# EAGLE design roadkill (EAGLE 6.1)

## Sheet 1 of 5
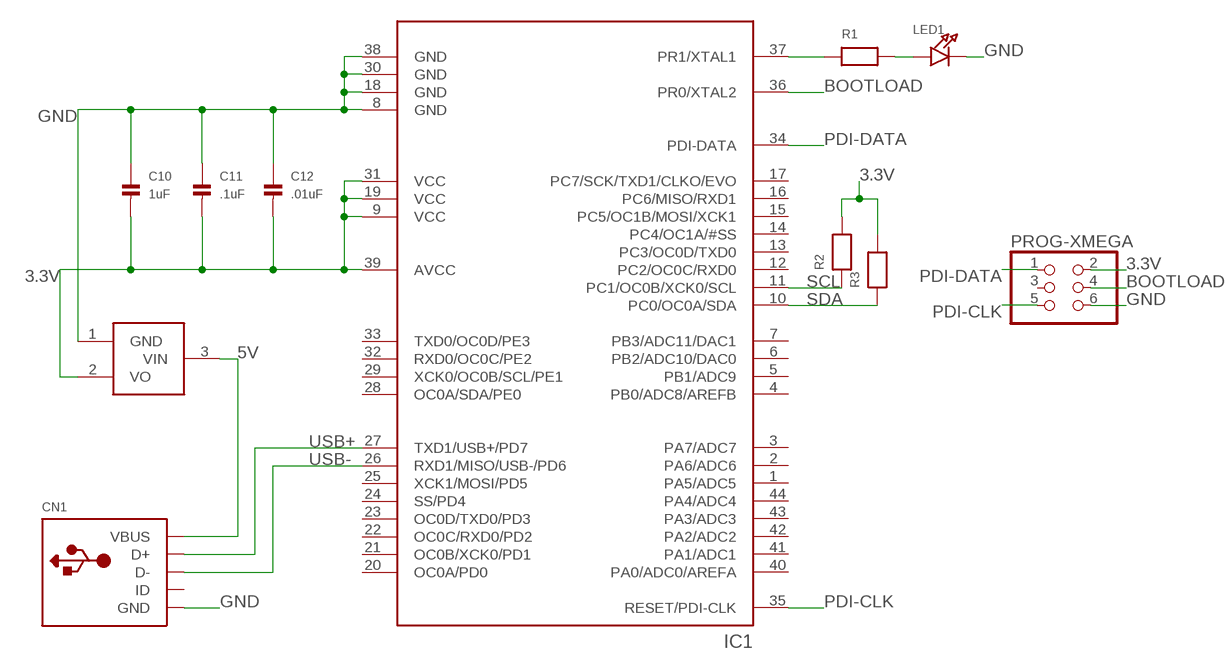
[diagram p0: schematic, sheet 1]

### Parts
3.3V  VREG  [SOT23-3]
C10  1uF  CAP_CERAMIC0603  [0603]
C11  .1uF  CAP_CERAMIC0603  [0603]
C12  .01uF  CAP_CERAMIC0603  [0603]
CN1  USBMINIB  [USB-MINIB]
IC1  ATXMEGAXXA4U  [TQFP-44]
LED1  LED0603  [CHIPLED_0603]
PROG-XMEGA  HEADER-2X3  [2X03]
R1  RESISTOR0603  [0603]
R2  RESISTOR0603  [0603]
R3  RESISTOR0603  [0603]

### Nets
3.3V: 3.3V.2(VO) C10.2 C11.2 C12.2 IC1.9(VCC) IC1.19(VCC) IC1.31(VCC) IC1.39(AVCC) PROG-XMEGA.2 R2.2 R3.2 ; also sheet 2,3,4,5
5V: 3.3V.3(VIN) CN1.VBUS
BOOTLOAD: IC1.36(PR0/XTAL2) PROG-XMEGA.4
GND: 3.3V.1(GND) C10.1 C11.1 C12.1 CN1.GND IC1.8(GND) IC1.18(GND) IC1.30(GND) IC1.38(GND) LED1.C PROG-XMEGA.6 ; also sheet 2,3,4,5
PDI-CLK: IC1.35(RESET/PDI-CLK) PROG-XMEGA.5
PDI-DATA: IC1.34(PDI-DATA) PROG-XMEGA.1
PR1: IC1.37(PR1/XTAL1) R1.1
PR1-P: LED1.A R1.2
SCL: IC1.11(PC1/OC0B/XCK0/SCL) R2.1 ; also sheet 2,3,4,5
SDA: IC1.10(PC0/OC0A/SDA) R3.1 ; also sheet 2,3,4,5
USB+: CN1.D+ IC1.27(TXD1/USB+/PD7)
USB-: CN1.D- IC1.26(RXD1/MISO/USB-/PD6)
Unconnected: CN1.ID IC1.1(PA5/ADC5) IC1.2(PA6/ADC6) IC1.3(PA7/ADC7) IC1.4(PB0/ADC8/AREFB) IC1.5(PB1/ADC9) IC1.6(PB2/ADC10/DAC0) IC1.7(PB3/ADC11/DAC1) IC1.12(PC2/OC0C/RXD0) IC1.13(PC3/OC0D/TXD0) IC1.14(PC4/OC1A/#SS) IC1.15(PC5/OC1B/MOSI/XCK1) IC1.16(PC6/MISO/RXD1) IC1.17(PC7/SCK/TXD1/CLKO/EVO) IC1.20(OC0A/PD0) IC1.21(OC0B/XCK0/PD1) IC1.22(OC0C/RXD0/PD2) IC1.23(OC0D/TXD0/PD3) IC1.24(SS/PD4) IC1.25(XCK1/MOSI/PD5) IC1.28(OC0A/SDA/PE0) IC1.29(XCK0/OC0B/SCL/PE1) IC1.32(RXD0/OC0C/PE2) IC1.33(TXD0/OC0D/PE3) IC1.40(PA0/ADC0/AREFA) IC1.41(PA1/ADC1) IC1.42(PA2/ADC2) IC1.43(PA3/ADC3) IC1.44(PA4/ADC4) PROG-XMEGA.3

## Sheet 2 of 5
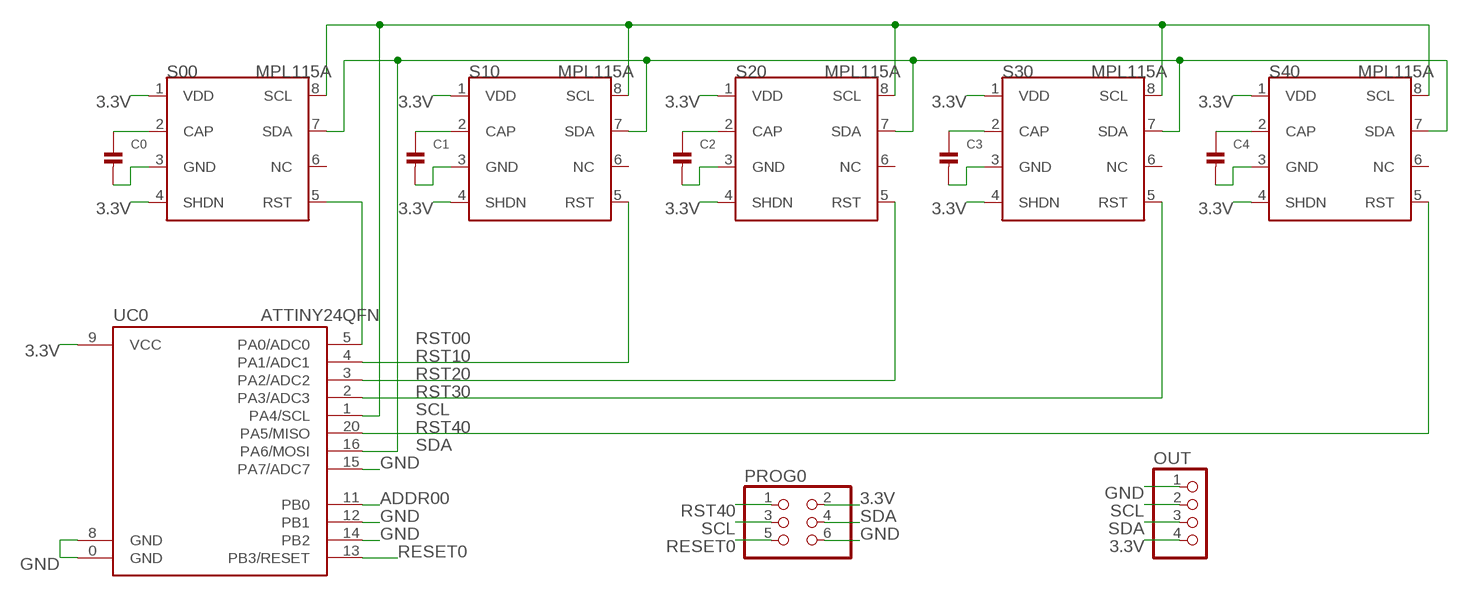
[diagram p1: schematic, sheet 2]

### Parts
C0  CAP_CERAMIC0603  [0603]
C1  CAP_CERAMIC0603  [0603]
C2  CAP_CERAMIC0603  [0603]
C3  CAP_CERAMIC0603  [0603]
C4  CAP_CERAMIC0603  [0603]
OUT  HEADER-1X4  [1X04_OVAL]
PROG0  HEADER-2X3  [2X03]
S00  MPL115A  [LGA-8]
S10  MPL115A  [LGA-8]
S20  MPL115A  [LGA-8]
S30  MPL115A  [LGA-8]
S40  MPL115A  [LGA-8]
UC0  ATTINY24QFN  [QFN20]

### Nets
3.3V: OUT.4 PROG0.2 S00.1(VDD) S00.4(SHDN) S10.1(VDD) S10.4(SHDN) S20.1(VDD) S20.4(SHDN) S30.1(VDD) S30.4(SHDN) S40.1(VDD) S40.4(SHDN) UC0.9(VCC) ; also sheet 1,3,4,5
ADDR00: UC0.11(PB0)
CAP00: C0.1 S00.2(CAP)
CAP10: C1.1 S10.2(CAP)
CAP20: C2.1 S20.2(CAP)
CAP30: C3.1 S30.2(CAP)
CAP40: C4.1 S40.2(CAP)
GND: C0.2 C1.2 C2.2 C3.2 C4.2 OUT.1 PROG0.6 S00.3(GND) S10.3(GND) S20.3(GND) S30.3(GND) S40.3(GND) UC0.0(GND) UC0.8(GND) UC0.12(PB1) UC0.14(PB2) UC0.15(PA7/ADC7) ; also sheet 1,3,4,5
RESET0: PROG0.5 UC0.13(PB3/RESET)
RST00: S00.5(RST) UC0.5(PA0/ADC0)
RST10: S10.5(RST) UC0.4(PA1/ADC1)
RST20: S20.5(RST) UC0.3(PA2/ADC2)
RST30: S30.5(RST) UC0.2(PA3/ADC3)
RST40: PROG0.1 S40.5(RST) UC0.20(PA5/MISO)
SCL: OUT.2 PROG0.3 S00.8(SCL) S10.8(SCL) S20.8(SCL) S30.8(SCL) S40.8(SCL) UC0.1(PA4/SCL) ; also sheet 1,3,4,5
SDA: OUT.3 PROG0.4 S00.7(SDA) S10.7(SDA) S20.7(SDA) S30.7(SDA) S40.7(SDA) UC0.16(PA6/MOSI) ; also sheet 1,3,4,5
Unconnected: S00.6(NC) S10.6(NC) S20.6(NC) S30.6(NC) S40.6(NC)

## Sheet 3 of 5
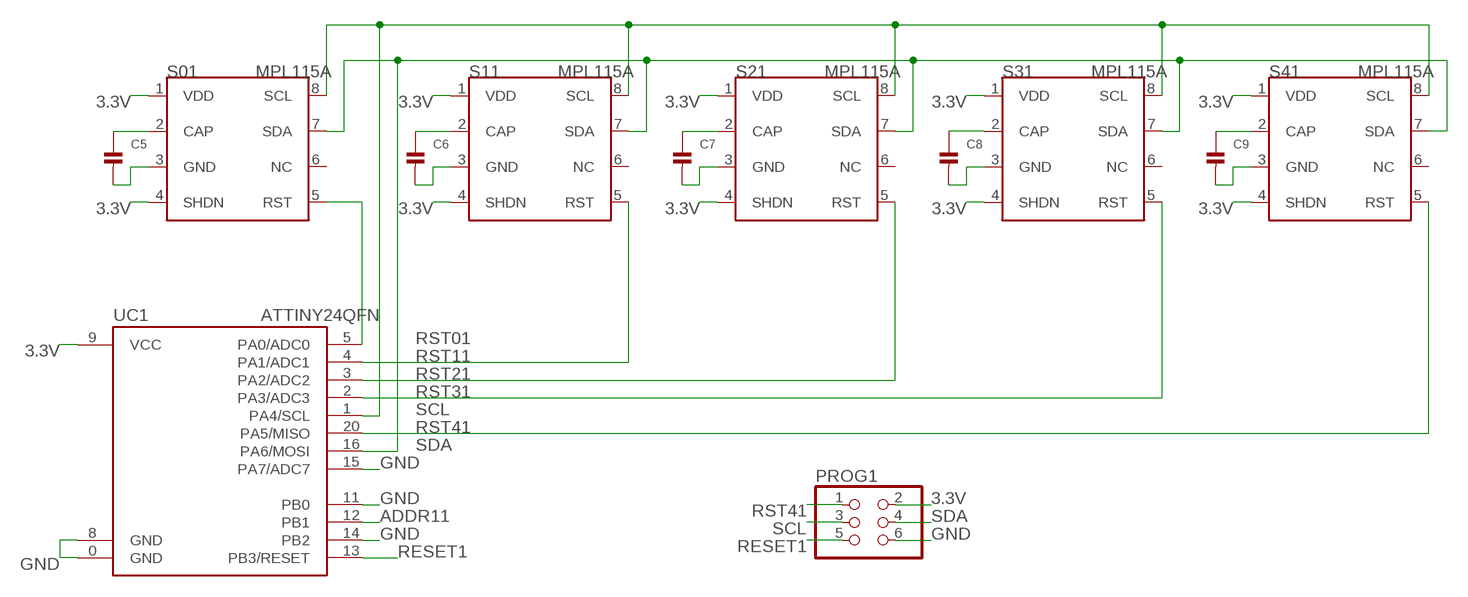
[diagram p2: schematic, sheet 3]

### Parts
C5  CAP_CERAMIC0603  [0603]
C6  CAP_CERAMIC0603  [0603]
C7  CAP_CERAMIC0603  [0603]
C8  CAP_CERAMIC0603  [0603]
C9  CAP_CERAMIC0603  [0603]
PROG1  HEADER-2X3  [2X03]
S01  MPL115A  [LGA-8]
S11  MPL115A  [LGA-8]
S21  MPL115A  [LGA-8]
S31  MPL115A  [LGA-8]
S41  MPL115A  [LGA-8]
UC1  ATTINY24QFN  [QFN20]

### Nets
3.3V: PROG1.2 S01.1(VDD) S01.4(SHDN) S11.1(VDD) S11.4(SHDN) S21.1(VDD) S21.4(SHDN) S31.1(VDD) S31.4(SHDN) S41.1(VDD) S41.4(SHDN) UC1.9(VCC) ; also sheet 1,2,4,5
ADDR11: UC1.12(PB1)
CAP01: C5.1 S01.2(CAP)
CAP11: C6.1 S11.2(CAP)
CAP21: C7.1 S21.2(CAP)
CAP31: C8.1 S31.2(CAP)
CAP41: C9.1 S41.2(CAP)
GND: C5.2 C6.2 C7.2 C8.2 C9.2 PROG1.6 S01.3(GND) S11.3(GND) S21.3(GND) S31.3(GND) S41.3(GND) UC1.0(GND) UC1.8(GND) UC1.11(PB0) UC1.14(PB2) UC1.15(PA7/ADC7) ; also sheet 1,2,4,5
RESET1: PROG1.5 UC1.13(PB3/RESET)
RST01: S01.5(RST) UC1.5(PA0/ADC0)
RST11: S11.5(RST) UC1.4(PA1/ADC1)
RST21: S21.5(RST) UC1.3(PA2/ADC2)
RST31: S31.5(RST) UC1.2(PA3/ADC3)
RST41: PROG1.1 S41.5(RST) UC1.20(PA5/MISO)
SCL: PROG1.3 S01.8(SCL) S11.8(SCL) S21.8(SCL) S31.8(SCL) S41.8(SCL) UC1.1(PA4/SCL) ; also sheet 1,2,4,5
SDA: PROG1.4 S01.7(SDA) S11.7(SDA) S21.7(SDA) S31.7(SDA) S41.7(SDA) UC1.16(PA6/MOSI) ; also sheet 1,2,4,5
Unconnected: S01.6(NC) S11.6(NC) S21.6(NC) S31.6(NC) S41.6(NC)

## Sheet 4 of 5
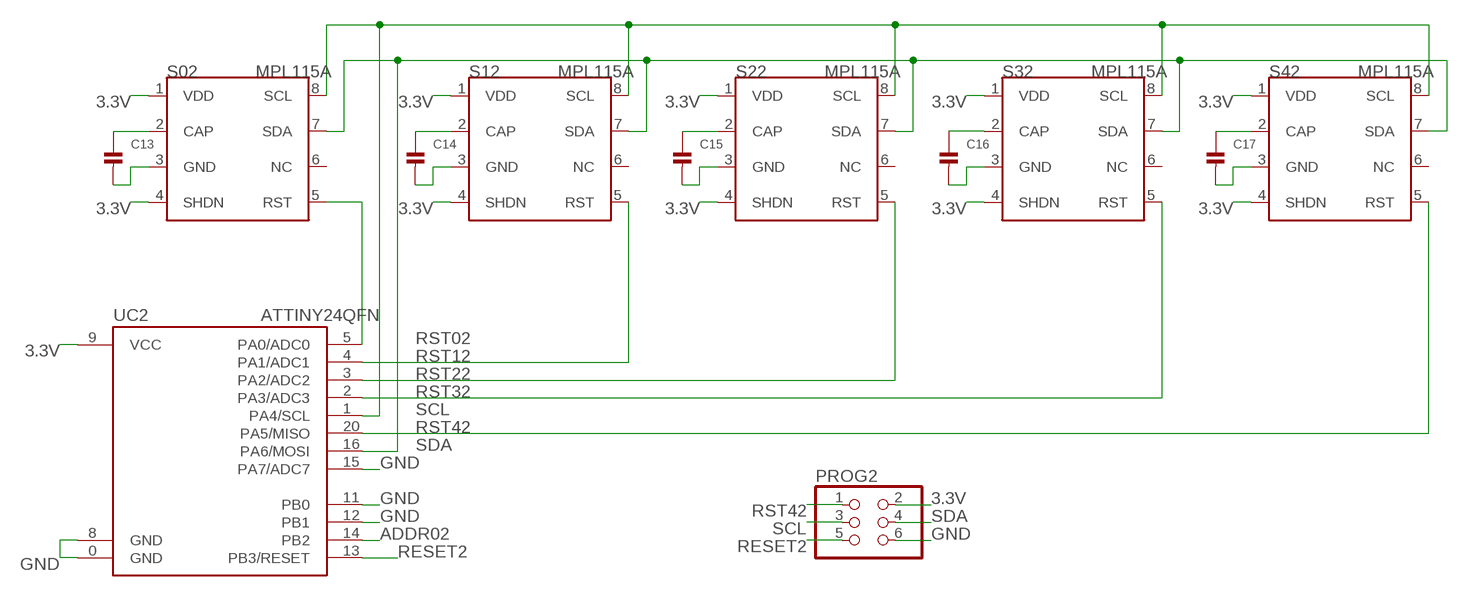
[diagram p3: schematic, sheet 4]

### Parts
C13  CAP_CERAMIC0603  [0603]
C14  CAP_CERAMIC0603  [0603]
C15  CAP_CERAMIC0603  [0603]
C16  CAP_CERAMIC0603  [0603]
C17  CAP_CERAMIC0603  [0603]
PROG2  HEADER-2X3  [2X03]
S02  MPL115A  [LGA-8]
S12  MPL115A  [LGA-8]
S22  MPL115A  [LGA-8]
S32  MPL115A  [LGA-8]
S42  MPL115A  [LGA-8]
UC2  ATTINY24QFN  [QFN20]

### Nets
3.3V: PROG2.2 S02.1(VDD) S02.4(SHDN) S12.1(VDD) S12.4(SHDN) S22.1(VDD) S22.4(SHDN) S32.1(VDD) S32.4(SHDN) S42.1(VDD) S42.4(SHDN) UC2.9(VCC) ; also sheet 1,2,3,5
ADDR02: UC2.14(PB2)
CAP02: C13.1 S02.2(CAP)
CAP12: C14.1 S12.2(CAP)
CAP22: C15.1 S22.2(CAP)
CAP32: C16.1 S32.2(CAP)
CAP42: C17.1 S42.2(CAP)
GND: C13.2 C14.2 C15.2 C16.2 C17.2 PROG2.6 S02.3(GND) S12.3(GND) S22.3(GND) S32.3(GND) S42.3(GND) UC2.0(GND) UC2.8(GND) UC2.11(PB0) UC2.12(PB1) UC2.15(PA7/ADC7) ; also sheet 1,2,3,5
RESET2: PROG2.5 UC2.13(PB3/RESET)
RST02: S02.5(RST) UC2.5(PA0/ADC0)
RST12: S12.5(RST) UC2.4(PA1/ADC1)
RST22: S22.5(RST) UC2.3(PA2/ADC2)
RST32: S32.5(RST) UC2.2(PA3/ADC3)
RST42: PROG2.1 S42.5(RST) UC2.20(PA5/MISO)
SCL: PROG2.3 S02.8(SCL) S12.8(SCL) S22.8(SCL) S32.8(SCL) S42.8(SCL) UC2.1(PA4/SCL) ; also sheet 1,2,3,5
SDA: PROG2.4 S02.7(SDA) S12.7(SDA) S22.7(SDA) S32.7(SDA) S42.7(SDA) UC2.16(PA6/MOSI) ; also sheet 1,2,3,5
Unconnected: S02.6(NC) S12.6(NC) S22.6(NC) S32.6(NC) S42.6(NC)

## Sheet 5 of 5
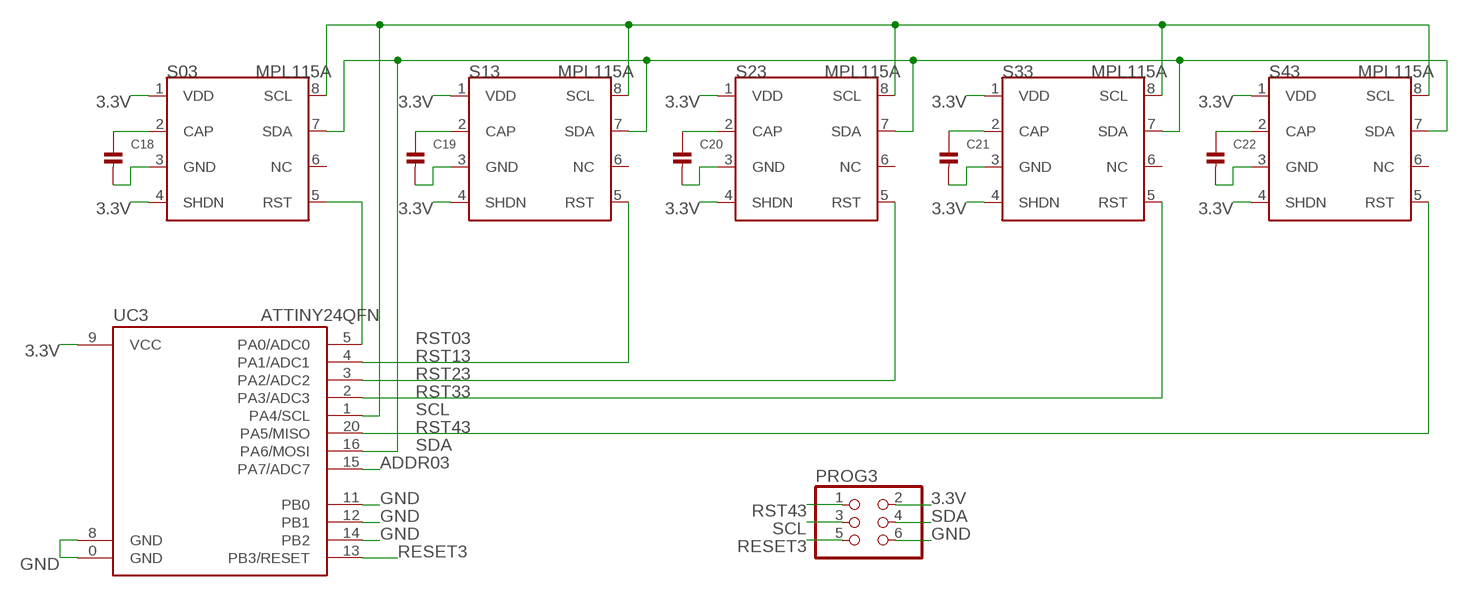
[diagram p4: schematic, sheet 5]

### Parts
C18  CAP_CERAMIC0603  [0603]
C19  CAP_CERAMIC0603  [0603]
C20  CAP_CERAMIC0603  [0603]
C21  CAP_CERAMIC0603  [0603]
C22  CAP_CERAMIC0603  [0603]
PROG3  HEADER-2X3  [2X03]
S03  MPL115A  [LGA-8]
S13  MPL115A  [LGA-8]
S23  MPL115A  [LGA-8]
S33  MPL115A  [LGA-8]
S43  MPL115A  [LGA-8]
UC3  ATTINY24QFN  [QFN20]

### Nets
3.3V: PROG3.2 S03.1(VDD) S03.4(SHDN) S13.1(VDD) S13.4(SHDN) S23.1(VDD) S23.4(SHDN) S33.1(VDD) S33.4(SHDN) S43.1(VDD) S43.4(SHDN) UC3.9(VCC) ; also sheet 1,2,3,4
ADDR03: UC3.15(PA7/ADC7)
CAP03: C18.1 S03.2(CAP)
CAP13: C19.1 S13.2(CAP)
CAP23: C20.1 S23.2(CAP)
CAP33: C21.1 S33.2(CAP)
CAP43: C22.1 S43.2(CAP)
GND: C18.2 C19.2 C20.2 C21.2 C22.2 PROG3.6 S03.3(GND) S13.3(GND) S23.3(GND) S33.3(GND) S43.3(GND) UC3.0(GND) UC3.8(GND) UC3.11(PB0) UC3.12(PB1) UC3.14(PB2) ; also sheet 1,2,3,4
RESET3: PROG3.5 UC3.13(PB3/RESET)
RST03: S03.5(RST) UC3.5(PA0/ADC0)
RST13: S13.5(RST) UC3.4(PA1/ADC1)
RST23: S23.5(RST) UC3.3(PA2/ADC2)
RST33: S33.5(RST) UC3.2(PA3/ADC3)
RST43: PROG3.1 S43.5(RST) UC3.20(PA5/MISO)
SCL: PROG3.3 S03.8(SCL) S13.8(SCL) S23.8(SCL) S33.8(SCL) S43.8(SCL) UC3.1(PA4/SCL) ; also sheet 1,2,3,4
SDA: PROG3.4 S03.7(SDA) S13.7(SDA) S23.7(SDA) S33.7(SDA) S43.7(SDA) UC3.16(PA6/MOSI) ; also sheet 1,2,3,4
Unconnected: S03.6(NC) S13.6(NC) S23.6(NC) S33.6(NC) S43.6(NC)

## Library data of the parts
3.3V = nonolith:VREG
C0 C1-C22 = nonolith:CAP_CERAMIC: Ceramic Capacitors 0402 - 0402 Surface Mount Capacitors 0.1uF 10V 10% [Digikey: 490-1318-2-ND] 0603 - 0603 Surface Mount Capacitors 16 pF 50V 5% [Digikey: 445-5051-2-ND] 22 pF 50V [Digikey: PCC220ACVTR-ND] 33 pF 50V 5% [Digikey: 490-1415-1-ND] 56pF 50V 5% [Digikey: 490-1421-1-ND] 220pF 50V 5% [Digikey: 445-1285-1-ND] 680 pF 50V 2200 pF 50V 5% C0G [Digikey: 445-1297-1-ND] 5600 pF 100V 5% X7R [Digikey: 478-3711-1-ND] 0.1 µF 25V 10% [Digikey: PCC2277TR-ND] 0.22 µF 16V 10% X7R [Digikey: 445-1318-1-ND] 1.0 µF 25V 10% [Digikey: 445-5146-2-ND] 0603 - RF Specific 3pF 250V +/-0.1pF RF [Digikey: 712-1347-1-ND] 18 pF 250V 5% [Digikey: 478-3505-1-ND or 712-1322-1-ND] 56 pF 250V 5% C0G RF [Digikey: 490-4867-1-ND] 68 pF 250V RF [Digikey: 490-4868-1-ND] 0805 - 0805 Surface Mount Capacitors 220 pF 250V 2% RF Ceramic Capacitor [Digikey: 712-1398-1-ND] 1000 pF 50V 2% NP0 Ceramic Capacitor [Digikey: 478-3760-1-ND] 0.1 µF 25V 10% Ceramic Capacitor [Digikey: PCC1828TR-ND] 1.0 µF 16V 10% Ceramic Capacitor[Digikey: 490-1691-2-ND] 10.0 µF 10V 10% Ceramic Capacitor[Digikey: 709-1228-1-ND] 1206 - 1206 Surface Mount Capacitors
CN1 = nonolith:USB: USB Connectors USBMINIB - Surface Mount Female Mini-B USB Connector 4UConnector: 06564 By microbuilder.eu
IC1 = nonolith:ATXMEGAXXA4U: ATXMEGA A4U Series (XMEGA+USB)
LED1 = microbuilder:LED: LED 0603 - 0603 Surface Mount Package 2mA: Green LED - Low Power (3.9mcd, 2ma, 1.7Vf) - Digikey: 475-2709-2-ND Orange LED - Low Power (9.8mcd, 2ma, 1.8Vf) - Digikey: 475-1194-2-ND Red LED - Low Power (5mcd, 2ma, 1.8Vf) - Digikey: 475-1195-2-ND Yellow LED - Low Power (7mcd, 2ma, 1.8Vf) - Digikey: 475-1196-2-ND 5mA: Blue LED - Low Power (17mcd, 5ma, 2.9Vf) - Digikey: LNJ937W8CRACT-ND 0805 - 0805 Surface Mount Package 2mA: Red LED (8.8mcd, 2mA, 1.8Vf, Clear) - Low Power [Digikey: 475-2510-1-ND] Green LED (5mcd, 2mA, 1.8Vf, Clear) - Low Power [Digikey: 475-2730-1-ND] Yellow LED (11.3mcd, 2mA, 1.8Vf, Clear) - Low Power [Digikey: 475-2555-1-ND] 20mA: Red LED (104mcd, 20mA, Diffused) - LS R976 [Digikey: 475-1278-6-ND] Red LED (12mcd, 20mA, 2.0Vf, Clear) - APT2012EC [Digikey: 754-1128-1-ND] Green LED (15mcd, 20mA, 2.2Vf, Clear) - APT2012GC [Digikey: 754-1131-1-ND] Orange LED (160mcd, 20mA, 2.1Vf, Clear) - APT2012SECK [Digikey: 754-1130-1-ND] 1206 - 1206 Surface Mount Package Green LED (26mcd, 20mA, Diffused) - LG N971 [Digikey: 475-1407-6-ND] Red LED (15mcd, 20mA, Diffused) - LH N974 [Digikey: 475-1416-6-ND]
OUT = nonolith:HEADER-1X4: PIN HEADER
PROG0 PROG1-PROG3 PROG-XMEGA = nonolith:HEADER-2X3: PIN HEADER
R1-R3 = nonolith:RESISTOR: Resistors 0402 - 0402 Surface Mount Package 10.0K 1% 1/16W [Digikey: 311-10.0KLRTR-ND] 0603 - 0603 Surface Mount Package 0 Ohm 1/10 Watt 1% Resistor 15 Ohm 1/10 Watt 1% Resistor 33 Ohm 1/10 Watt 1% Resistor 49.9 Ohm 1/10 Watt 1% Resistor 100 Ohm 1/10 Watt 1% Resistor 150 Ohm 1/10 Watt 1% Resistor 240 Ohm 1/10 Watt 1% Resistor 390 Ohm 1/10 Watt 1% Resistor 560 Ohm 1/10 Watt 1% Resistor 750 Ohm 1/10 Watt 1% Resistor 1.0K Ohm 1/10 Watt 1% Resistor 1.5K Ohm 1/10 Watt 1% Resistor 2.0K Ohm 1/10 Watt 1% Resistor 4.7K Ohm 1/10 Watt 1% Resistor 10.0K Ohm 1/10 Watt 1% Resistor 20.0K Ohm 1/10 Watt 1% Resistor 33.0K Ohm 1/10 Watt 1% Resistor 100.0K Ohm 1/10 Watt 1% Resistor 0805 - 0805 Surface Mount Package 0 Ohm 1/8 Watt 1% Resistor 33 Ohm 1/8 Watt 1% Resistor 100 Ohm 1/8 Watt 1% Resistor 150 Ohm 1/8 Watt 1% Resistor 200 Ohm 1/8 Watt 1% Resistor 240 Ohm 1/8 Watt 1% Resistor 330 Ohm 1/8 Watt 1% Resistor 390 Ohm 1/8 Watt 1% Resistor 470 Ohm 1/8 Watt 1% Resistor 1.0K Ohm 1/8 Watt 1% Resistor 1.5K Ohm 1/8 Watt 1% Resistor 2.0K Ohm 1/8 Watt 1% Resistor 4.7K Ohm 1/8 Watt 1% Resistor 5.1K Ohm 1/8 Watt 1% Resistor 5.6K Ohm 1/8 Watt 1% Resistor 10.0K Ohm 1/8 Watt 1% Resistor 22.0K Ohm 1/8 Watt 1% Resistor 33.0K Ohm 1/8 Watt 1% Resistor 100K Ohm 1/8 Watt 1% Resistor 1206 - 1206 Surface Mount Package
S00 S01-S03 S10-S13 S20-S23 S30-S33 S40-S43 = nonolith:MPL115A: MPL115A1 (SPI) and MPL115A2 (I2C) Miniature Digital Barometer 5.0x3.0x1.2mm LGA Package
UC0 UC1-UC3 = nonolith:ATTINY24

## Board
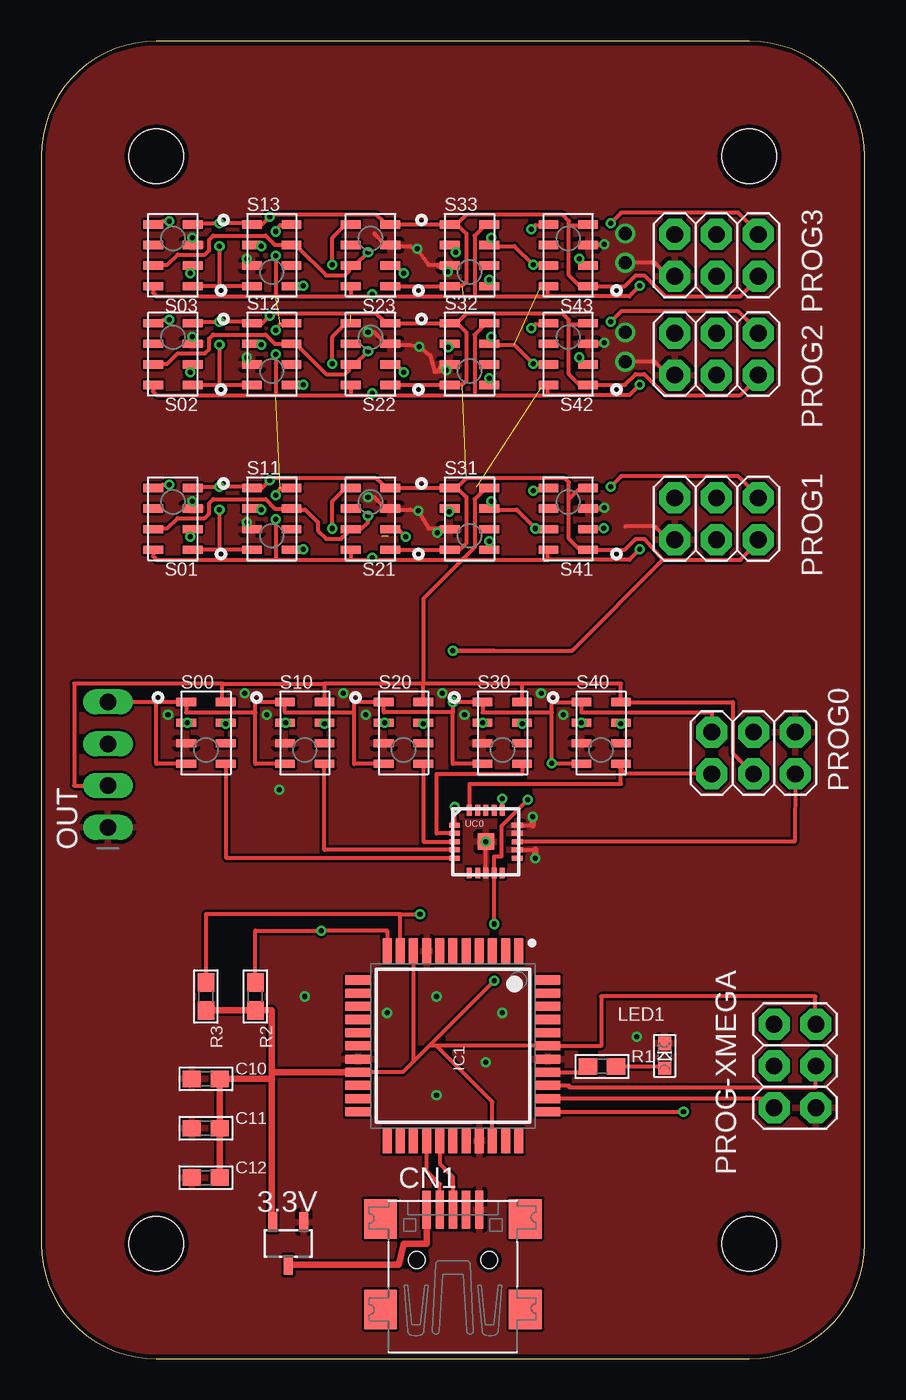
[diagram p5: board, top side]
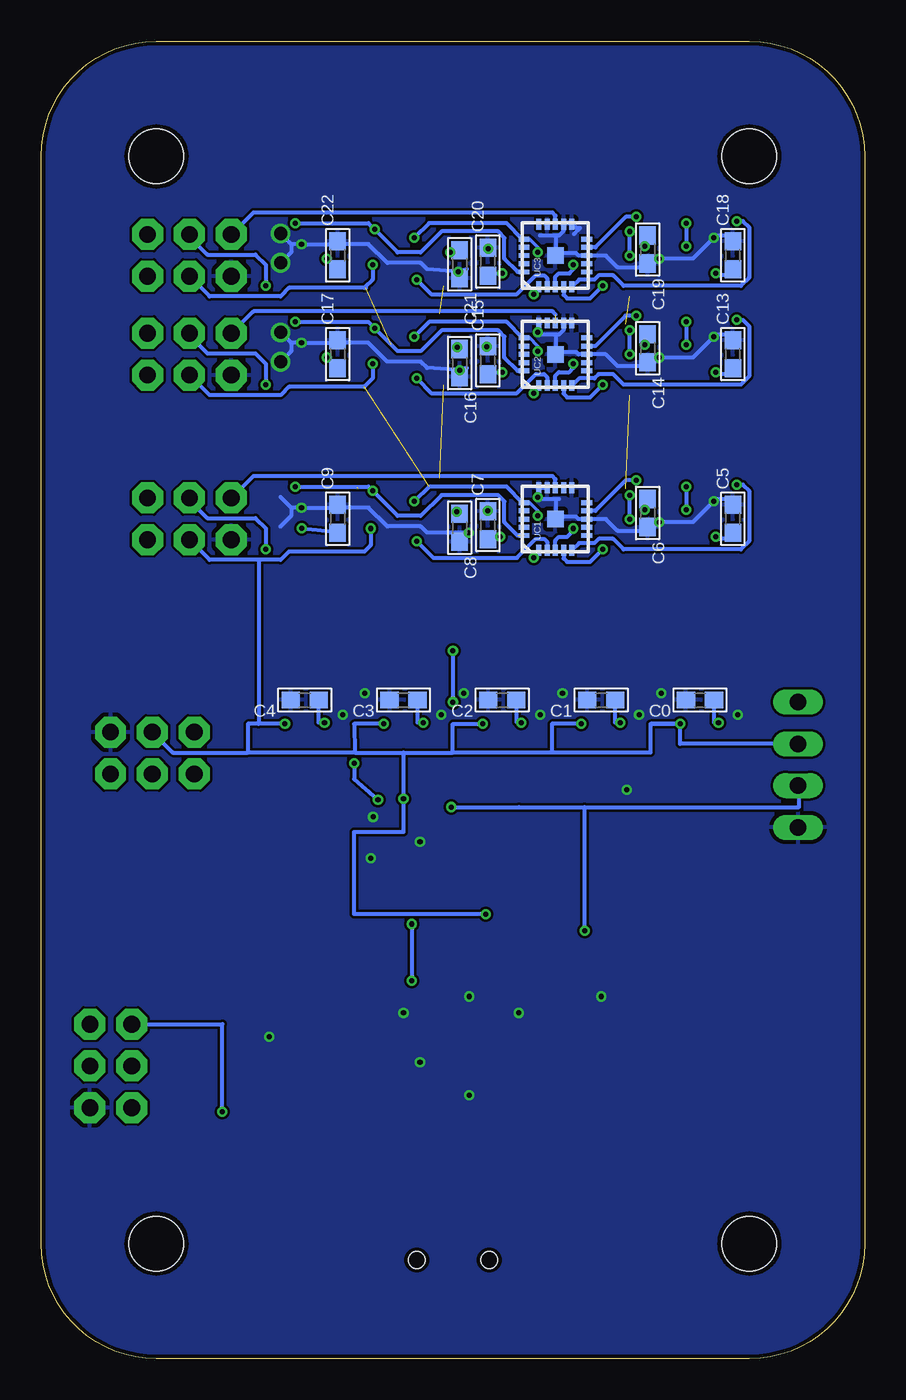
[diagram p6: board, bottom side, seen from below]

Size 50 x 80 mm. Coordinates in mm from the lower left corner, seen from the top.
Outline: 43,80 7,80 arc90 0,73 0,7 arc90 7,0 43,0 arc90 50,7 50,73 arc90 43,80
Copper layers (1*16): Top 0.035mm / dielectric 1.5mm / Bottom 0.035mm
Design rules: minimum track width 6mil, minimum drill 12mil, track to track 6mil, track to pad 6mil, pad to pad 6mil, via to via 6mil, smd to smd 0mil, copper to edge 10mil, drill to drill 10mil, minimum pad ring 10mil, minimum via ring 6mil, stop-mask expansion 2mil, vias tented up to drill 100mil, thermal gap 10mil

### Footprints (pad centres in the part's own frame; a part is rotated, then mirrored left to right if it is on the bottom)
SOT23-3 = smd 0.55 x 1.2: 1 0.95,1.3; 2 -0.95,1.3; 3 0,-1.3
0603 = smd 1.1 x 1: 1 -0.85,0; 2 0.85,0
USB-MINIB = smd 0.5 x 2.308: D+ 0,4.064; D- -0.8,4.064; GND 1.6,4.064; ID 0.8,4.064; VBUS -1.6,4.064 | smd 2 x 2.4: GND1 -4.4,-2; GND2 -4.4,3.5; GND3 4.4,3.5; GND4 4.4,-2 | hole 1: -2.2,1; 2.2,1
TQFP-44 = smd 1.55 x 0.55: 1 -5.75,4; 2 -5.75,3.2; 3 -5.75,2.4; 4 -5.75,1.6; 5 -5.75,0.8; 6 -5.75,0; 7 -5.75,-0.8; 8 -5.75,-1.6; 9 -5.75,-2.4; 10 -5.75,-3.2; 11 -5.75,-4; 23 5.75,-4; 24 5.75,-3.2; 25 5.75,-2.4; 26 5.75,-1.6; 27 5.75,-0.8; 28 5.75,0; 29 5.75,0.8; 30 5.75,1.6; 31 5.75,2.4; 32 5.75,3.2; 33 5.75,4 | smd 0.55 x 1.55: 12 -4,-5.75; 13 -3.2,-5.75; 14 -2.4,-5.75; 15 -1.6,-5.75; 16 -0.8,-5.75; 17 0,-5.75; 18 0.8,-5.75; 19 1.6,-5.75; 20 2.4,-5.75; 21 3.2,-5.75; 22 4,-5.75; 34 4,5.75; 35 3.2,5.75; 36 2.4,5.75; 37 1.6,5.75; 38 0.8,5.75; 39 0,5.75; 40 -0.8,5.75; 41 -1.6,5.75; 42 -2.4,5.75; 43 -3.2,5.75; 44 -4,5.75
CHIPLED_0603 = smd 0.8 x 0.8: A 0,-0.75; C 0,0.75
1X04_OVAL = drill 1 long: 1 -3.81,0; 2 -1.27,0; 3 1.27,0; 4 3.81,0
2X03 = drill 1.016 pad 1.88 octagon: 1 -2.54,-1.27; 2 -2.54,1.27; 3 0,-1.27; 4 0,1.27; 5 2.54,-1.27; 6 2.54,1.27
LGA-8 = smd 1.2 x 0.5: 1 -1.2,1.875; 2 -1.2,0.625; 3 -1.2,-0.625; 4 -1.2,-1.875; 5 1.2,-1.875; 6 1.2,-0.625; 7 1.2,0.625; 8 1.2,1.875
STAND-OFF = hole 3.302: 0,0
QFN20 = smd 1 x 1: 0 0,0 | smd 0.65 x 0.3: 1 -1.9,1; 2 -1.9,0.5; 3 -1.9,0; 4 -1.9,-0.5; 5 -1.9,-1; 11 1.9,-1; 12 1.9,-0.5; 13 1.9,0; 14 1.9,0.5; 15 1.9,1 | smd 0.3 x 0.65: 6 -1,-1.9; 7 -0.5,-1.9; 8 0,-1.9; 9 0.5,-1.9; 10 1,-1.9; 16 1,1.9; 17 0.5,1.9; 18 0,1.9; 19 -0.5,1.9; 20 -1,1.9

### Placement (x,y rotation side)
3.3V  15,7 0 top
C0  10,40 180 bottom
C1  16,40 180 bottom
C2  22,40 180 bottom
C3  28,40 180 bottom
C4  34,40 180 bottom
C5  8,51 90 bottom
C6  13.18,51.35 270 bottom
C7  22.88,50.62 90 bottom
C8  24.59,50.46 270 bottom
C9  32,51 90 bottom
C10  10,17 0 top
C11  10,14 0 top
C12  10,11 0 top
C13  8,61 90 bottom
C14  13.18,61.35 270 bottom
C15  22.88,60.62 90 bottom
C16  24.59,60.46 270 bottom
C17  32,61 90 bottom
C18  8,67 90 bottom
C19  13.18,67.35 270 bottom
C20  22.88,66.62 90 bottom
C21  24.59,66.46 270 bottom
C22  32,67 90 bottom
CN1  25,5 0 top
IC1  25,19 270 top
LED1  37.85,18.4 0 top
OUT  4.05,36.07 90 top
PROG0  43.25,36.78 0 top
PROG1  41,51 180 top
PROG2  41,61 180 top
PROG3  41,67 180 top
PROG-XMEGA  45.77,17.78 270 top
R1  34.05,17.75 0 top
R2  13,22 270 top
R3  10,22 270 top
S00  10,38 0 top
S01  8,51 180 top
S02  8,61 180 top
S03  8,67 180 top
S10  16,38 0 top
S11  14,51 0 top
S12  14,61 0 top
S13  14,67 0 top
S20  22,38 0 top
S21  20,51 180 top
S22  20,61 180 top
S23  20,67 180 top
S30  28,38 0 top
S31  26,51 0 top
S32  26,61 0 top
S33  26,67 0 top
S40  34,38 0 top
S41  32,51 180 top
S42  32,61 180 top
S43  32,67 180 top
U$1  [STAND-OFF]  7,7 0 top
U$2  [STAND-OFF]  43,7 0 top
U$3  [STAND-OFF]  7,73 0 top
U$4  [STAND-OFF]  43,73 0 top
UC0  27,31.4 0 top
UC1  18.78,50.99 90 bottom
UC2  18.78,60.99 90 bottom
UC3  18.78,66.99 90 bottom

### Tracks (layer width: path | path; a pad name or v marks a point on that pad's centre or on a via)
3.3V  (via drill 0.3, 0.31)  (2 unrouted)
  Top 0.254: v27.5,22.95 23.55,19 | IC1.19 21.95,17.4 22.6,18.05 | IC1.9 22.6,18.05 | 24,19 IC1.39 34,19 34,22 47,22 47,20.32 PROG-XMEGA.2 | 24,19 23.55,19 | 23.55,19 22.6,18.05 | IC1.31 27.4,15.6 24,19 | S00.4 7,36.12 7,39.88 | 7,39.88 S00.1 8.8,39.25 13,39.25 | S10.4 13,36.12 13,39.25 | 13,39.25 13,39.88 S10.1 14.8,39.25 19,39.25 | 19,39.25 19,39.88 S20.1 20.8,39.25 25,39.25 | S30.4 25,36.12 25,39.25 | 31,39.25 v31,36.15 31,36.12 S40.4 | 31,39.25 31,39.88 S40.1 32.8,39.25 40.7,39.25 PROG0.2 | 31,39.25 26.8,39.25 S30.1 v25,39.88 25,39.25 | S20.4 19,36.12 19,39.25 | OUT.4 7,39.88 | v29.55,33.95 27.95,32.35 27.95,30.5 27.5,30.5 UC0.9 v27.5,26.4 | 27.5,43 v25,43 32.24,43 37.75,48.51 | S31.1 S21.4 20.82,52.99 20.35,53.46 14,53.46 v13.87,53.33 13.41,52.88 S11.1 | S21.1 S31.4 24.69,49.12 24.67,49.14 25.43,49.14 25.81,49.52 25.81,52.32 25.18,52.95 24.8,52.95 S31.1 | S11.1 12.75,52.83 | 32.03,52.19 32.67,52.83 33.18,52.83 33.2,52.85 S41.4 | 12.35,52.95 12.6,52.95 S11.1 | 12.86,52.83 12.85,52.83 | 12.85,52.83 S11.1 | S01.4 9.48,52.88 9.68,52.95 v10.83,52.95 12.35,52.95 | S01.1 9.22,49.14 10.83,49.14 | 10.83,49.14 12.22,49.14 | 12.22,49.14 12.24,49.12 S11.4 12.84,49.12 12.86,49.14 | 12.85,52.83 12.48,52.83 12.35,52.95 | v10.83,51.56 10.83,49.14 | 12.22,49.14 12.86,49.14 | 12.98,49.14 12.86,49.14 | 32.03,52.19 32.03,49.78 32.67,49.14 33.18,49.14 S41.1 35.45,49.12 36.1,49.78 36.61,49.78 37.75,48.51 | 32.03,52.19 32.03,53.21 31.78,53.46 25.81,53.46 25.18,52.83 24.85,52.83 S31.1 | 37.75,48.51 42.45,48.51 43.47,49.52 PROG1.2 | S32.1 S22.4 20.82,62.99 20.35,63.46 14,63.46 v13.87,63.33 13.41,62.88 S12.1 | S22.1 S32.4 24.69,59.12 24.67,59.14 25.56,59.14 25.81,59.4 25.81,62.32 25.18,62.95 24.8,62.95 S32.1
  Top 0.254: S12.1 12.75,62.83 | 32.03,62.83 33.18,62.83 33.2,62.85 S42.4 | 12.35,62.95 12.6,62.95 S12.1 | 12.86,62.83 12.85,62.83 | 12.85,62.83 S12.1 | S02.4 9.48,62.88 9.68,62.95 v10.83,62.95 12.35,62.95 | S02.1 9.22,59.14 10.83,59.14 | 10.83,59.14 12.22,59.14 | 12.22,59.14 12.24,59.12 S12.4 12.84,59.12 12.86,59.14 | 12.85,62.83 12.48,62.83 12.35,62.95 | v10.83,61.56 10.83,59.14 | 12.22,59.14 12.86,59.14 | 12.98,59.14 12.86,59.14 | 32.03,62.83 32.03,59.78 32.67,59.14 33.18,59.14 S42.1 35.45,59.12 36.1,59.78 36.61,59.78 37.88,58.51 42.45,58.51 43.47,59.52 PROG2.2 | 32.03,62.83 32.03,63.08 31.65,63.46 25.81,63.46 25.18,62.83 24.85,62.83 S32.1 | S33.1 S23.4 20.82,68.99 20.35,69.46 14,69.46 v13.87,69.33 13.41,68.88 S13.1 | S23.1 S33.4 24.69,65.12 24.67,65.14 25.56,65.14 25.81,65.4 25.81,68.32 25.18,68.95 24.8,68.95 S33.1 | S13.1 12.75,68.83 | 32.03,68.83 33.18,68.83 33.2,68.85 S43.4 | 12.35,68.95 12.6,68.95 S13.1 | 12.86,68.83 12.85,68.83 | 12.85,68.83 S13.1 | S03.4 9.48,68.88 9.68,68.95 v10.83,68.95 12.35,68.95 | S03.1 9.22,65.14 10.83,65.14 | 10.83,65.14 12.22,65.14 | 12.22,65.14 12.24,65.12 S13.4 12.84,65.12 12.86,65.14 | 12.85,68.83 12.48,68.83 12.35,68.95 | v10.83,67.56 10.83,65.14 | 12.22,65.14 12.86,65.14 | 12.98,65.14 12.86,65.14 | 32.03,68.83 32.03,65.78 32.67,65.14 33.18,65.14 S43.1 35.45,65.12 36.1,65.78 36.61,65.78 37.88,64.51 42.45,64.51 43.47,65.52 PROG3.2 | 32.03,68.83 32.03,69.08 31.65,69.46 25.81,69.46 25.18,68.83 24.85,68.83 S33.1
  Top 0.406: C12.2 C11.2 C10.2 14,17 | 14,17 14,9 3.3V.2 | IC1.19 14,17.4 | 14,17.4 14,17 | R3.2 R2.2 14,21.15 14,17.4
  Bottom 0.254: v27.5,26.4 v27.5,22.95 | v31,36.15 31,35.2 v29.55,33.95 | v25,43 v25,39.88 | v13.87,53.33 14.51,53.33 16.36,51.49 UC1.9 | v10.83,52.95 v10.83,51.56 | v13.87,63.33 14.51,63.33 16.36,61.49 UC2.9 | v10.83,62.95 v10.83,61.56 | v13.87,69.33 14.51,69.33 16.36,67.49 UC3.9 | v10.83,68.95 v10.83,67.56
5V
  Top 0.406: CN1.VBUS 23.4,7 22.7,7 22,7 21.7,5.7 3.3V.3 | 14.95,5.7 3.3V.3 | 3.3V.3 15,6
BOOTLOAD
  Top 0.254: IC1.36 32.05,16.6 32.05,16.5 47.04,16.5 PROG-XMEGA.4
CAP00  (via drill 0.31)
  Top 0.254: S00.2 v8.88,38.62
  Bottom 0.254: v8.88,38.62 9.15,38.62 C0.1
CAP01  (via drill 0.3)
  Top 0.254: v9.05,49.91 9.05,50.29 9.18,50.41 | 9.18,50.29 9.18,50.41 | 9.18,50.41 S01.2
  Bottom 0.254: C5.1 8.03,50.12 8.03,49.91 8.16,49.78 8.79,49.78 8.92,49.78 v9.05,49.91
CAP02  (via drill 0.3)
  Top 0.254: v9.05,59.91 9.05,60.29 9.18,60.41 | 9.18,60.29 9.18,60.41 | 9.18,60.41 S02.2
  Bottom 0.254: C13.1 8.03,60.12 8.03,59.91 8.16,59.78 8.79,59.78 8.92,59.78 v9.05,59.91
CAP03  (via drill 0.3)
  Top 0.254: v9.05,65.91 9.05,66.29 9.18,66.41 | 9.18,66.29 9.18,66.41 | 9.18,66.41 S03.2
  Bottom 0.254: C18.1 8.03,66.12 8.03,65.91 8.16,65.78 8.79,65.78 8.92,65.78 v9.05,65.91
CAP10  (via drill 0.31)
  Top 0.254: 14.72,38.55 S10.2 v14.85,38.62
  Bottom 0.254: v14.85,38.62 15.15,38.62 C1.1
CAP11  (via drill 0.3)
  Top 0.254: 12.73,51.56 S11.2 13.3,51.62 v13.37,51.56
  Bottom 0.254: v13.37,51.56 13.37,51.94 13.44,51.94 C6.1
CAP12  (via drill 0.3)
  Top 0.254: 12.73,61.56 S12.2 13.3,61.62 v13.37,61.56
  Bottom 0.254: v13.37,61.56 13.37,61.94 13.44,61.94 C14.1
CAP13  (via drill 0.3)
  Top 0.254: 12.73,67.56 S13.2 13.3,67.62 v13.37,67.56
  Bottom 0.254: v13.37,67.56 13.37,67.94 13.44,67.94 C19.1
CAP20  (via drill 0.31)
  Top 0.254: 20.73,38.55 v20.85,38.62 S20.2
  Bottom 0.254: C2.1 21.15,38.65 21,38.65 | 21,38.65 20.85,38.65 | v20.85,38.62 21,38.62 21,38.65
CAP21  (via drill 0.3)
  Top 0.254: v22.13,49.91 21.62,50.41 21.24,50.41 S21.2
  Bottom 0.254: v22.13,49.91 22.75,49.9 22.77,49.9 22.89,50.03 22.89,49.91 23.02,49.78 23.01,49.77 C7.1
CAP22  (via drill 0.3)
  Top 0.254: v22,59.91 21.62,60.29 21.62,60.41 21.24,60.41 S22.2
  Bottom 0.254: v22,59.91 22.75,59.9 22.77,59.9 22.89,60.03 22.89,59.91 23.02,59.78 23.01,59.77 C15.1
CAP23  (via drill 0.3)
  Top 0.254: v22,65.91 21.62,66.29 21.62,66.41 21.24,66.41 S23.2
  Bottom 0.254: v22,65.91 22.75,65.9 22.77,65.9 22.89,66.03 22.89,65.91 23.02,65.78 23.01,65.77 C20.1
CAP30  (via drill 0.31)
  Top 0.254: 26.77,38.6 S30.2
  Bottom 0.254: S30.2 27.15,38.62 C3.1
  other vias: 26.8,38.62
CAP31  (via drill 0.3)
  Top 0.254: v24.78,51.42 25.18,51.56 S31.2
  Bottom 0.254: C8.1 24.8,51.56 24.8,51.17 v24.78,51.42
CAP32  (via drill 0.3)
  Top 0.254: v24.73,61.42 25.18,61.56 S32.2
  Bottom 0.254: C16.1 24.8,61.56 24.35,61.42 v24.73,61.42
CAP33  (via drill 0.3)
  Top 0.254: v25.18,67.17 25.18,67.56 S33.2
  Bottom 0.254: C21.1 24.8,67.56 24.8,67.17 v25.18,67.17
CAP40  (via drill 0.31)
  Top 0.254: 32.73,38.55 S40.2
  Bottom 0.254: S40.2 33.15,38.62 C4.1
  other vias: 32.8,38.62
CAP41  (via drill 0.3)
  Top 0.254: S41.2 33.33,50.36 v34.17,50.42
  Bottom 0.254: v34.17,50.42 32.08,50.2 C9.1
CAP42  (via drill 0.3)
  Top 0.254: S42.2 32.73,60.41 32.73,60.61 32.67,60.67 v32.67,60.79
  Bottom 0.254: v32.67,60.79 32.08,60.2 C17.1
CAP43  (via drill 0.3)
  Top 0.254: S43.2 32.73,66.41 32.73,66.61 32.67,66.67 v32.67,66.79
  Bottom 0.254: v32.67,66.79 32.08,66.2 C22.1
GND  (via drill 0.3, 0.31, 0.8)
  Top 0.254: UC0.8 UC0.0 | UC0.15 29.85,32.4 | UC0.12 30,30.9 | 24.03,50.41 23.53,50.41 v22.89,51.49 22.38,51.56 21.49,51.56 21.37,51.68 21.26,51.68 S21.3 21.04,51.62 20.99,51.68 20.86,51.68 20.22,52.32 v19.84,52.32 | S31.3 24.83,50.38 24.54,50.41 | S01.3 9.18,51.65 v9.18,52.06 | 24.03,50.41 24.54,50.41 | 24.54,50.41 S31.3 | S11.3 12.48,50.44 v12.48,50.79 | 38.5,49.75 38.48,49.73 PROG1.6 38.05,49.73 37.24,50.54 35.46,50.54 | S31.3 24.03,50.38 | 24.03,50.38 24.03,50.41 | 24.03,50.38 v24.03,50.16 | 23.88,59.91 23.63,60.91 v22.95,61.44 22.38,61.56 21.49,61.56 21.37,61.68 21.26,61.68 S22.3 21.04,61.62 20.99,61.68 20.86,61.68 20.22,62.32 v19.84,62.32 | S32.3 24.83,60.38 24.54,60.41 | S02.3 9.18,61.65 v9.18,62.06 | 23.88,59.91 24.54,60.41 | 24.54,60.41 S32.3 | S12.3 12.48,60.44 v12.48,60.79 | 38.5,59.75 38.48,59.73 PROG2.6 38.05,59.73 37.24,60.54 v35.46,60.54 | S32.3 24.03,59.92 | 24.03,59.92 23.88,59.91 | 24.03,59.92 v24.58,60.01 | 24.03,66.41 23.53,66.41 v22.84,67.39 22.38,67.56 21.49,67.56 21.37,67.68 21.26,67.68 S23.3 21.04,67.62 20.99,67.68 20.86,67.68 20.22,68.32 | S33.3 24.83,66.38 24.54,66.41 | S03.3 9.18,67.65 v9.18,68.06 | 24.03,66.41 24.54,66.41 | 24.54,66.41 S33.3 | S13.3 12.48,66.44 v12.48,66.79 | 38.5,65.75 38.48,65.73 PROG3.6 38.05,65.73 37.24,66.54 v35.46,66.54 | S33.3 24.03,66.38 | 24.03,66.38 24.03,66.41 | 24.03,66.38 v24.68,66.01 | S41.3 34.15,51.62 v34.19,51.68 34.19,51.62 S41.3 | S42.3 34.15,61.62 v34.19,61.68 34.19,61.62 S42.3 | S43.3 34.15,67.62 v34.19,67.68 34.19,67.62 S43.3
  Top 0.406: 29.85,32.4 v29.85,32.9 | 30,30.9 v30,30.4
  Bottom 0.254: UC1.14 UC1.15 19.78,52.38 v19.84,52.32 19.72,52.19 18.77,52.19 | 18.77,52.19 18.77,51.23 UC1.0 18.83,51.06 | 18.57,52.19 18.77,52.19 | C5.2 8.16,52.01 8.16,52.06 8.29,52.06 8.41,52.19 9.05,52.19 v9.18,52.06 10.45,50.79 v12.48,50.79 12.86,50.41 13.37,50.41 13.43,50.35 | 18.83,51.06 18.83,51.17 18.7,51.05 18.64,51.11 17.5,51.11 17.37,50.99 UC1.8 15.72,50.99 15.02,50.29 13.49,50.29 13.43,50.35 | 18.83,51.05 18.83,51.06 | C8.2 24.71,49.61 24.16,50.16 v24.03,50.16 26.57,50.16 26.95,50.54 28.99,50.54 30.13,51.68 31.83,51.68 C9.2 32.03,51.81 32.16,51.68 v34.19,51.68 34.83,51.68 | C7.2 23.14,51.61 23.14,51.81 22.76,51.81 23.14,51.3 v22.89,51.49 | C6.2 13.56,50.38 13.43,50.35 | 34.83,51.68 35.46,52.32 | 34.83,51.68 34.83,51.17 35.46,50.54 | 18.77,62.19 18.77,61.23 UC2.0 18.83,61.06 | UC2.12 18.28,62.48 18.57,62.19 18.77,62.19 | 18.77,62.19 19.72,62.19 v19.84,62.32 19.78,62.38 UC2.15 | C13.2 8.16,62.01 8.16,62.06 8.29,62.06 8.41,62.19 9.05,62.19 v9.18,62.06 10.45,60.79 v12.48,60.79 12.86,60.41 13.37,60.41 13.43,60.35 | 18.83,61.06 18.83,61.17 18.7,61.05 18.64,61.11 17.5,61.11 17.37,60.99 UC2.8 15.72,60.99 15.02,60.29 13.49,60.29 13.43,60.35 | 18.83,61.05 18.83,61.06 | C16.2 24.71,59.61 24.16,60.16 v24.58,60.01 26.57,60.16 26.95,60.54 28.99,60.54 30.13,61.68 31.83,61.68 C17.2 32.03,61.81 32.16,61.68 v34.19,61.68 34.83,61.68 | C15.2 23.14,61.61 23.14,61.81 22.76,61.81 23.14,61.3 v22.95,61.44 | C14.2 13.56,60.38 13.43,60.35 | 34.83,61.68 v35.46,62.32 | 34.83,61.68 34.83,61.17 v35.46,60.54 | 18.77,68.19 18.77,67.23 UC3.0 18.83,67.06 | UC3.12 18.28,68.48 18.57,68.19 18.77,68.19
  Bottom 0.254: 18.77,68.19 19.72,68.19 | C18.2 8.16,68.01 8.16,68.06 8.29,68.06 8.41,68.19 9.05,68.19 v9.18,68.06 10.45,66.79 v12.48,66.79 12.86,66.41 13.37,66.41 13.43,66.35 | 18.83,67.06 18.83,67.17 18.7,67.05 18.64,67.11 17.5,67.11 17.37,66.99 UC3.8 15.72,66.99 15.02,66.29 13.49,66.29 13.43,66.35 | 18.83,67.05 18.83,67.06 | C21.2 24.71,65.61 24.16,66.16 v24.68,66.01 26.57,66.16 26.95,66.54 28.99,66.54 30.13,67.68 31.83,67.68 C22.2 32.03,67.81 32.16,67.68 v34.19,67.68 34.83,67.68 | C20.2 23.14,67.61 23.14,67.81 22.76,67.81 23.14,67.3 v22.84,67.39 | C19.2 13.56,66.38 13.43,66.35 | 34.83,67.68 v35.46,68.32 | 34.83,67.68 34.83,67.17 v35.46,66.54 | 17.65,68.3 17.3,68.65 17.54,68.65 UC3.11 17.89,69 18,69 17.4,68.6
  other vias: 36.15,19.55 16,22 21,21 24,22 28,21 27,18 24,16 13.7,39.1 19.7,39.1 25.7,39.1 31.7,39.1 7.7,39.1 12.35,40.4 18.35,40.4 24.35,40.4 30.35,40.4 14.45,34.55 27,31.4
  pour Top: 0,0 43,0 arc90 50,7 50,73 arc90 43,80 0,80
  pour Bottom: 0,0 43,0 arc90 50,7 50,73 arc90 43,80 0,80
  pour Top: 0,28 50,28 50,43 0,43
  pour Bottom: 0,28 50,28 49,44 -1,44
  pour Bottom: 45.5,47.87 45.5,54.1 5.37,53.97 5.24,48
  pour Top: 5.37,54.1 5.62,47.75 45.5,47.87 45.24,54.22
  pour Bottom: 45.5,58 45.5,64 5.5,64 5.5,58
  pour Top: 5.5,64 5.5,58 45.5,58 45.5,64
  pour Bottom: 45.5,64 45.5,70 5.5,70 5.5,64
  pour Top: 5.5,70 5.5,64 45.5,64 45.5,70
PDI-CLK
  Top 0.254: PROG-XMEGA.5 44.5,15.8 IC1.35
PDI-DATA  (via drill 0.31)
  Top 0.254: IC1.34 v39,15
  Bottom 0.254: v39,15 39,20.32 PROG-XMEGA.1
PR1
  Top 0.254: IC1.37 33,17.4 33,18 33.2,18 R1.1
PR1-P
  Top 0.254: R1.2 37.85,17.75 LED1.A
RESET0
  Top 0.254: PROG0.5 45.74,31.4 UC0.13
RESET1
  Bottom 0.254: UC1.13 18.78,53.39 18.78,53.41 18.95,53.59 37.12,53.59 38.43,52.27 PROG1.5
RESET2  (1 unrouted)
  Bottom 0.254: 18.78,63.39 18.78,63.41 18.95,63.59 37.12,63.59 38.43,62.27 PROG2.5
RESET3
  Bottom 0.254: UC3.13 18.78,69.39 18.78,69.41 18.95,69.59 37.12,69.59 38.43,68.27 PROG3.5
RST00
  Top 0.254: UC0.5 11.25,30.4 11.25,36.15 11,36.15 11,36.12 | S00.5 11,36.12 | 11,36.12 11,36
RST01  (via drill 0.3)
  Top 0.254: S01.5 7.09,52.88 7.14,52.83 7.4,53.08 v7.78,53.08
  Bottom 0.254: v7.78,53.08 7.4,53.08 7.02,52.7 7.02,49.65 7.52,49.14 14.64,49.14 15.27,49.78 16.16,49.78 16.41,49.52 17.34,49.52 UC1.5
RST02  (via drill 0.3)
  Top 0.254: S02.5 7.09,62.88 7.14,62.83 7.4,63.08 v7.78,63.08
  Bottom 0.254: v7.78,63.08 7.4,63.08 7.02,62.7 7.02,59.65 7.52,59.14 14.64,59.14 15.27,59.78 16.16,59.78 16.41,59.52 17.34,59.52 UC2.5
RST03  (via drill 0.3)
  Top 0.254: S03.5 7.09,68.88 7.14,68.83 7.4,69.08 v7.78,69.08
  Bottom 0.254: v7.78,69.08 7.4,69.08 7.02,68.7 7.02,65.65 7.52,65.14 14.64,65.14 15.27,65.78 16.16,65.78 16.41,65.52 17.34,65.52 UC3.5
RST10
  Top 0.254: UC0.4 17.2,30.9 S10.5
RST11  (via drill 0.3)
  Top 0.254: v15.91,49.14 15.22,49.14 S11.5
  Bottom 0.254: UC1.4 18.28,48.59 18.07,48.38 16.67,48.38 v15.91,49.14
RST12  (via drill 0.3)
  Top 0.254: v15.91,59.14 15.22,59.14 S12.5
  Bottom 0.254: UC2.4 18.28,58.59 18.07,58.38 16.67,58.38 v15.91,59.14
RST13  (via drill 0.3)
  Top 0.254: v15.91,65.14 15.22,65.14 S13.5
  Bottom 0.254: UC3.4 18.28,64.59 18.07,64.38 16.67,64.38 v15.91,65.14
RST20
  Top 0.254: S20.5 23.2,31.4 UC0.3
RST21  (via drill 0.3)
  Top 0.254: 18.45,52.83 18.75,52.83 S21.5 18.52,52.88 18.45,52.95 18.45,52.83 | v17.68,50.41 17.68,52.06 18.45,52.83
  Bottom 0.254: UC1.3 18.78,49.7 18.57,49.91 18.07,49.91 17.81,50.16 v17.68,50.41
RST22  (via drill 0.3)
  Top 0.254: 18.45,62.83 18.75,62.83 S22.5 18.52,62.88 18.45,62.95 18.45,62.83 | v17.68,60.41 17.68,62.06 18.45,62.83
  Bottom 0.254: UC2.3 18.78,59.7 18.57,59.91 17.94,59.91 17.68,60.16 v17.68,60.41
RST23  (via drill 0.3)
  Top 0.254: 18.45,68.83 18.75,68.83 S23.5 18.52,68.88 18.45,68.95 18.45,68.83 | v17.68,66.41 17.68,68.06 18.45,68.83
  Bottom 0.254: UC3.3 18.78,65.7 18.57,65.91 17.94,65.91 17.68,66.16 v17.68,66.41
RST30
  Top 0.254: 29.2,36.2 S30.5 29.2,35.5 24,35.5 24,31.9 UC0.2
RST31  (via drill 0.3)
  Top 0.254: S31.5 27.22,49.14 v27.21,49.65
  Bottom 0.254: v27.21,49.65 26.19,48.63 21.11,48.63 19.97,49.78 19.46,49.78 19.28,49.59 UC1.2
RST32  (via drill 0.3)
  Top 0.254: S32.5 27.22,59.14 v27.21,59.52
  Bottom 0.254: v27.21,59.52 26.32,58.63 21.11,58.63 19.97,59.78 19.46,59.78 19.28,59.59 UC2.2
RST33  (via drill 0.3)
  Top 0.254: S33.5 27.22,65.14 v27.21,65.52
  Bottom 0.254: v27.21,65.52 26.32,64.64 21.11,64.64 19.97,65.78 19.46,65.78 19.28,65.59 UC3.2
RST40
  Top 0.254: UC0.20 26,34.9 35.2,34.9 S40.5 35.08,36 35,36 35.49,35.51 PROG0.1
RST41  (via drill 0.3)  (2 unrouted)
  Top 0.254: v29.88,52.7 30,52.83 30.75,52.83 | PROG1.1 43.51,52.27 43.47,52.32 43.47,52.45 42.32,53.59 35.21,53.59 v34.58,52.95
  Bottom 0.254: 21.07,49.99 21.88,50.79 21.88,52.06 22.26,52.45 25.68,52.45 26.95,51.17 28.35,51.17 v29.88,52.7 30.13,52.95 v34.58,52.95
RST42  (via drill 0.3)
  Top 0.254: v29.75,62.57 30,62.83 30.75,62.83 S42.5 | PROG2.1 43.51,62.27 43.47,62.32 43.47,62.45 42.32,63.59 35.21,63.59 v34.58,62.95
  Bottom 0.254: UC2.20 21.07,59.99 21.88,60.79 21.88,62.06 22.26,62.45 25.68,62.45 26.95,61.17 28.35,61.17 v29.75,62.57 30.13,62.95 v34.58,62.95
RST43  (via drill 0.3)
  Top 0.254: v29.75,68.57 30,68.83 30.75,68.83 S43.5 | PROG3.1 43.51,68.27 43.47,68.32 43.47,68.44 42.32,69.59 35.21,69.59 v34.58,68.95
  Bottom 0.254: UC3.20 21.07,65.99 21.88,66.79 21.88,68.06 22.26,68.44 25.68,68.44 26.95,67.17 28.35,67.17 v29.75,68.57 30.13,68.95 v34.58,68.95
SCL  (via drill 0.3, 0.31)  (2 unrouted)
  Top 0.254: R2.1 13,26 v17,26 21,26 IC1.11 | S00.8 11,39.88 11,41 | 11,41 17.2,41 | 17.2,41 S10.8 | 23.2,41 S20.8 23.15,39.88 | 23.2,41 17.2,41 | S30.8 29.2,41 | 29.2,41 23.2,41 | 29.2,41 35.2,41 S40.8 42,39.88 42,36.76 PROG0.3 | 11,41 2,41 2,34.8 OUT.2 | UC0.1 v25.1,33.5 | S01.8 6.8,48.72 7.02,48.51 14.26,48.51 | 14.26,48.51 18.83,48.51 | 18.83,48.51 18.83,49.1 S21.8 18.8,48.53 18.83,48.51 | 25.56,48.51 20.1,48.51 v20.1,48.63 19.97,48.51 18.83,48.51 | 25.56,48.51 30.77,48.51 | 30.77,49.02 30.77,49.14 30.78,49.12 S41.8 30.8,49.05 30.77,49.02 | S31.8 27.25,52.83 26.95,52.83 26.32,52.19 26.32,49.27 25.56,48.51 | 15.02,52.83 15.25,52.83 | 15.27,52.83 15.25,52.83 | 15.25,52.83 S11.8 15.15,52.83 14.51,52.83 14.26,52.57 v14.26,52.45 | v14.26,50.98 14.26,48.51 | v36.35,49.14 35.72,48.51 30.77,48.51 | 30.8,48.54 30.77,48.51 | 30.77,48.51 30.77,49.02 | 25.56,48.51 23.2,46.15 23.2,41 | S02.8 6.8,58.72 7.02,58.51 14.26,58.51 | 14.26,58.51 18.83,58.51 | 18.83,58.51 18.83,59.1 S22.8 18.8,58.53 18.83,58.51 | 26.32,58.51 20.1,58.51 v20.1,58.63 19.97,58.51 18.83,58.51 | 26.32,58.51 30.77,58.51 | 30.77,59.02 30.77,59.14 30.78,59.12 S42.8 30.8,59.05 30.77,59.02 | S32.8 27.25,62.83 26.95,62.83 26.32,62.19 26.32,58.51 | 15.02,62.83 15.25,62.83 | 15.27,62.83 15.25,62.83 | 15.25,62.83 S12.8 15.15,62.83 14.51,62.83 14.26,62.57 v14.26,62.45 | v14.26,60.98 14.26,58.51 | v36.35,59.14 35.72,58.51 30.77,58.51 | 30.8,58.54 30.77,58.51 | 30.77,58.51 30.77,59.02 | S03.8 6.8,64.72 7.02,64.51 14.26,64.51 | 14.26,64.51 18.83,64.51 | 18.83,64.51 18.83,65.1 S23.8 18.8,64.53 18.83,64.51 | 26.32,64.51 20.1,64.51 v20.1,64.64 19.97,64.51 18.83,64.51 | 26.32,64.51 30.77,64.51
  Top 0.254: 30.77,65.02 30.77,65.14 30.78,65.12 S43.8 30.8,65.05 30.77,65.02 | S33.8 27.25,68.83 26.95,68.83 26.32,68.19 26.32,64.51 | 15.02,68.83 15.25,68.83 | 15.27,68.83 15.25,68.83 | 15.25,68.83 S13.8 15.15,68.83 14.51,68.83 14.26,68.57 v14.26,68.44 | v14.26,66.98 14.26,64.51 | v36.35,65.14 35.72,64.51 30.77,64.51 | 30.8,64.54 30.77,64.51 | 30.77,64.51 30.77,65.02
  Bottom 0.254: 21,33.5 v25.1,33.5 17,33.5 | 17,33.5 4,33.5 4,34.8 OUT.2 | v17,26 17,33.5 | v20.1,48.63 19.78,48.95 UC1.1 | v14.26,50.98 v14.26,52.45 | PROG1.3 40.98,52.27 40.92,52.32 40.92,52.06 39.91,51.05 36.99,51.05 36.35,50.41 v36.35,49.14 | v20.1,58.63 19.78,58.95 UC2.1 | v14.26,60.98 v14.26,62.45 | PROG2.3 40.98,62.27 40.92,62.32 40.92,62.06 39.91,61.05 36.99,61.05 36.35,60.41 v36.35,59.14 | v20.1,64.64 19.78,64.95 UC3.1 | v14.26,66.98 v14.26,68.44 | PROG3.3 40.98,68.27 40.92,68.32 40.92,68.06 39.91,67.05 36.99,67.05 36.35,66.41 v36.35,65.14
SDA  (via drill 0.3, 0.31)  (2 unrouted)
  Top 0.203: S21.7 19.04,50.38 19.08,50.41 | S22.7 19.04,60.38 19.08,60.41 | S23.7 19.04,66.38 19.08,66.41
  Top 0.254: IC1.10 21.8,27 | 21.8,27 10,27 R3.1 | v11.2,38.55 S00.7 | v17.2,38.55 S10.7 | 23.2,38.52 v23.2,38.55 S20.7 | v29.2,38.55 S30.7 | v35.2,38.55 S40.7 | UC0.16 v28,34 | 21.8,27 v23,27 | S01.7 7.14,50.41 7.65,50.41 8.29,51.05 9.94,51.05 10.19,51.3 10.19,51.94 10.45,52.19 13.62,52.19 14.19,51.62 S11.7 | 14.96,51.62 S11.7 | S11.7 15.27,51.56 15.4,51.68 15.4,51.56 16.03,51.56 16.8,50.79 16.8,50.29 17.3,49.78 18.19,49.78 18.57,50.16 18.57,50.21 18.74,50.38 S21.7 | 27.34,51.56 27.27,51.56 S31.7 27.52,51.62 | 27.52,51.62 27.34,51.56 | v27.34,52.06 27.34,51.56 | 19.08,50.41 19.46,50.41 19.84,50.79 v19.84,51.17 | 27.52,51.62 27.59,51.56 28.86,51.56 v30,50.41 30.76,50.41 S41.7 | S02.7 7.14,60.41 7.65,60.41 8.29,61.05 9.94,61.05 10.19,61.3 10.19,61.94 10.45,62.19 13.62,62.19 14.19,61.62 S12.7 | 14.96,61.62 S12.7 | S12.7 15.27,61.56 15.4,61.68 15.4,61.56 15.53,61.56 17.3,59.78 18.45,59.78 18.7,60.03 18.7,60.29 18.78,60.29 18.83,60.34 18.74,60.38 S22.7 | 27.34,61.56 27.27,61.56 S32.7 27.52,61.62 | 27.52,61.62 27.34,61.56 | v27.34,62.06 27.34,61.56 | 19.08,60.41 v19.84,61.17 | 27.52,61.62 27.59,61.56 28.73,61.56 v29.88,60.41 30.76,60.41 S42.7 | S03.7 7.14,66.41 7.65,66.41 8.29,67.05 9.94,67.05 10.19,67.3 10.19,67.94 10.45,68.19 13.62,68.19 14.19,67.62 S13.7 | 14.96,67.62 S13.7 | S13.7 15.27,67.56 15.4,67.68 15.4,67.56 15.53,67.56 17.3,65.78 18.45,65.78 18.7,66.03 18.7,66.29 18.78,66.29 18.83,66.34 18.74,66.38 S23.7 | 27.34,67.56 27.27,67.56 S33.7 27.52,67.62 | 27.52,67.62 27.34,67.56 | v27.34,68.06 27.34,67.56 | 19.08,66.41 v19.84,67.17 | 27.52,67.62 27.59,67.56 28.73,67.56 v29.88,66.41 30.76,66.41 S43.7
  Bottom 0.203: UC1.16 20.34,51.99 19.84,51.49 v19.84,51.17 | UC2.16 20.34,61.99 19.84,61.49 v19.84,61.17 | UC3.16 20.34,67.99 19.84,67.49 v19.84,67.17
  Bottom 0.254: 13,38.45 13,36.8 19,36.8 | 13,38.45 12.9,38.55 v11.2,38.55 | v11.2,38.55 13,38.55 13,38.45 | v17.2,38.55 19,38.55 19,36.8 | 30.95,36.8 31,38.55 v29.2,38.55 S30.7 | 30.95,36.8 28,36.8 | 36.8,38.55 v35.2,38.55 35.2,38.6 | 36.8,38.55 37.45,38.55 37.45,36.8 | 19,36.8 25,36.8 | 28,36.8 25,36.8 | PROG0.4 42,36.8 37.45,36.8 | 25,36.8 25,38.55 v23.2,38.55 | 28,36.8 v28,34 28,32 31,32 31,27 v23,27 | 30.95,36.8 37.45,36.8 | v11.2,38.55 11.2,37.34 OUT.3 | UC1.16 20.78,51.99 21.75,52.95 26.45,52.95 v27.34,52.06 | v30,50.41 30,49.4 30.38,49.02 34.96,49.02 35.46,48.51 36.8,48.51 | 36.8,48.51 39.78,48.51 PROG1.4 | 36.8,48.51 36.8,38.55 | UC2.16 20.78,61.99 21.75,62.95 26.45,62.95 v27.34,62.06 | v29.88,60.41 29.88,59.52 30.38,59.02 34.96,59.02 35.46,58.51 39.78,58.51 PROG2.4 | UC3.16 20.78,67.99 21.75,68.95 26.45,68.95 v27.34,68.06 | v29.88,66.41 29.88,65.52 30.38,65.02 | 30.38,65.02 34.96,65.02 35.46,64.51 39.78,64.51 PROG3.4 | 30.38,65.02 30.29,65.02
USB+
  Top 0.254: IC1.27 24.2,11.85 25,11.05 CN1.D+
USB-
  Top 0.254: CN1.D- 24.2,10.6 23.4,11.4 IC1.26